# EAGLE design qsop28_to_dip (EAGLE 6.2)
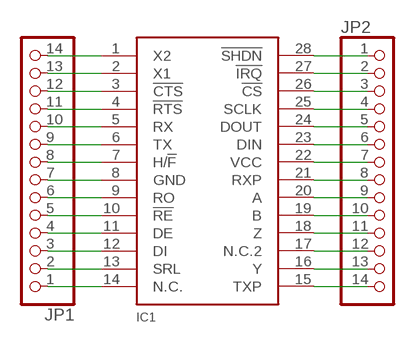
[diagram p0: schematic, sheet 1]

## Parts
IC1  MAX314028SQSOP  [28QSOP]
JP1  PINHD-1X14  [1X14]
JP2  PINHD-1X14  [1X14]

## Nets
N$1: IC1.1(X2) JP1.14
N$2: IC1.2(X1) JP1.13
N$3: IC1.3(!CTS) JP1.12
N$4: IC1.4(!RTS) JP1.11
N$5: IC1.5(RX) JP1.10
N$6: IC1.6(TX) JP1.9
N$7: IC1.7(H/!F) JP1.8
N$8: IC1.8(GND) JP1.7
N$9: IC1.9(RO) JP1.6
N$10: IC1.10(!RE) JP1.5
N$11: IC1.11(DE) JP1.4
N$12: IC1.12(DI) JP1.3
N$13: IC1.13(SRL) JP1.2
N$14: IC1.14(N.C.) JP1.1
N$15: IC1.28(!SHDN) JP2.1
N$16: IC1.27(!IRQ) JP2.2
N$17: IC1.26(!CS) JP2.3
N$18: IC1.25(SCLK) JP2.4
N$19: IC1.24(DOUT) JP2.5
N$20: IC1.23(DIN) JP2.6
N$21: IC1.22(VCC) JP2.7
N$22: IC1.21(RXP) JP2.8
N$23: IC1.20(A) JP2.9
N$24: IC1.19(B) JP2.10
N$25: IC1.18(Z) JP2.11
N$26: IC1.17(N.C.2) JP2.12
N$27: IC1.16(Y) JP2.13
N$28: IC1.15(TXP) JP2.14

## Library data of the parts
IC1 = eagleParts:MAX3140
JP1 JP2 = pinhead:PINHD-1X14: PIN HEADER

## Board
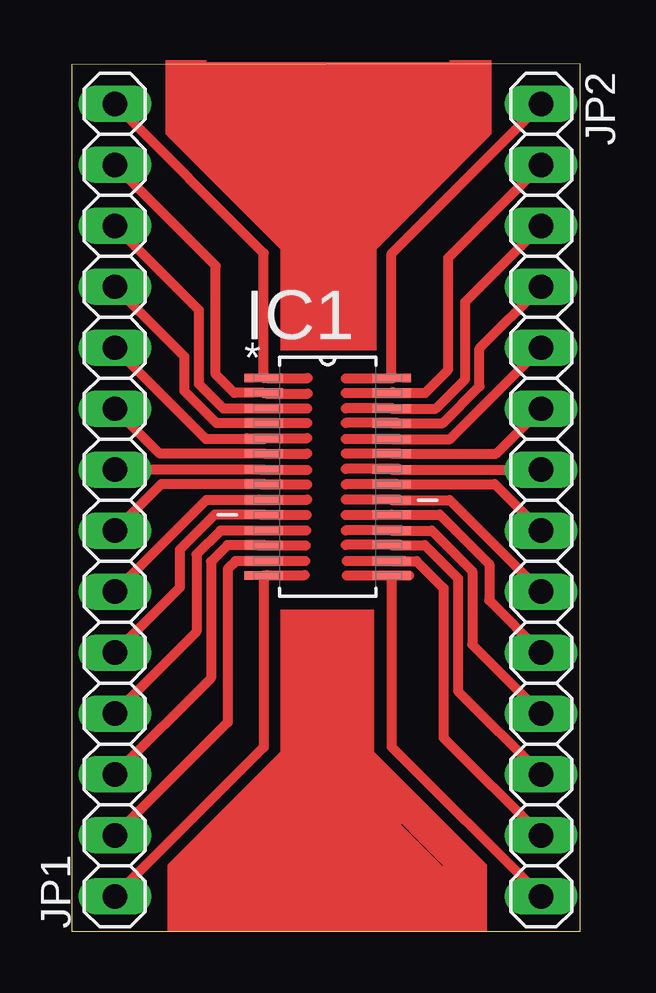
[diagram p1: board, top side]

Size 21.2 x 36.14 mm. Coordinates in mm from the lower left corner, seen from the top.
Outline: 0,0 21.2,0 21.2,36.14 0,36.1 0,0
Copper layers (1*16): Top 0.035mm / dielectric 1.5mm / Bottom 0.035mm
Design rules: minimum track width 10mil, minimum drill 24mil, track to track 8mil, track to pad 8mil, pad to pad 8mil, via to via 8mil, smd to smd 8mil, copper to edge 40mil, drill to drill 8mil, minimum pad ring 10mil, minimum via ring 8mil, stop-mask expansion 4mil, vias tented up to drill 0mil, thermal gap 10mil

### Footprints (pad centres in the part's own frame; a part is rotated, then mirrored left to right if it is on the bottom)
28QSOP = smd 1.6 x 0.356: 1 -2.667,4.115; 2 -2.667,3.505; 3 -2.667,2.845; 4 -2.667,2.235; 5 -2.667,1.575; 6 -2.667,0.965; 7 -2.667,0.305; 8 -2.667,-0.305; 9 -2.667,-0.965; 10 -2.667,-1.575; 11 -2.667,-2.235; 12 -2.667,-2.845; 13 -2.667,-3.505; 14 -2.667,-4.115; 15 2.667,-4.115; 16 2.667,-3.505; 17 2.667,-2.845; 18 2.667,-2.235; 19 2.667,-1.575; 20 2.667,-0.965; 21 2.667,-0.305; 22 2.667,0.305; 23 2.667,0.965; 24 2.667,1.575; 25 2.667,2.235; 26 2.667,2.845; 27 2.667,3.505; 28 2.667,4.115
1X14 = drill 1.016 long: 1 -16.51,0; 2 -13.97,0; 3 -11.43,0; 4 -8.89,0; 5 -6.35,0; 6 -3.81,0; 7 -1.27,0; 8 1.27,0; 9 3.81,0; 10 6.35,0; 11 8.89,0; 12 11.43,0; 13 13.97,0; 14 16.51,0

### Placement (x,y rotation side)
IC1  10.67,18.93 0 top
JP1  1.79,17.96 90 top
JP2  19.57,17.96 270 top

### Tracks (layer width: path | path; a pad name or v marks a point on that pad's centre or on a via)
N$1
  Top 0.406: IC1.1 8,28.26 JP1.14
N$2
  Top 0.406: IC1.2 6.77,22.44 6,23.2 6,27.72 JP1.13
N$3
  Top 0.406: IC1.3 6.33,21.77 5.3,22.8 5.3,25.88 JP1.12
N$4
  Top 0.406: IC1.4 6.04,21.16 4.7,22.5 4.7,23.94 JP1.11
N$5
  Top 0.406: IC1.5 5.6,20.51 JP1.10
N$6
  Top 0.406: IC1.6 3.67,19.9 JP1.9
N$7
  Top 0.406: IC1.7 JP1.8
N$8
  Top 0.406: IC1.8 3.72,18.62 JP1.7
N$9
  Top 0.406: IC1.9 5.61,17.96 JP1.6
N$10
  Top 0.406: IC1.10 5.96,17.35 4.5,15.9 4.5,14.32 JP1.5
N$11
  Top 0.406: IC1.11 6.2,16.7 5.2,15.7 5.2,12.48 JP1.4
N$12
  Top 0.406: IC1.12 6.49,16.09 5.8,15.4 5.8,10.54 JP1.3
N$13
  Top 0.406: IC1.13 6.83,15.42 6.5,15.1 6.5,8.7 JP1.2
N$14
  Top 0.406: IC1.14 8,7.66 JP1.1
N$15
  Top 0.406: IC1.28 13.34,28.24 JP2.1
N$16
  Top 0.406: IC1.27 14.74,22.44 15.7,23.4 15.7,28.06 JP2.2
N$17
  Top 0.406: IC1.26 15.17,21.77 16.4,23 16.4,26.22 JP2.3
N$18
  Top 0.406: IC1.25 15.47,21.16 17,22.7 17,24.28 JP2.4
N$19
  Top 0.406: IC1.24 15.76,20.51 JP2.5
N$20
  Top 0.406: IC1.23 17.7,19.9 JP2.6
N$21
  Top 0.406: IC1.22 JP2.7
N$22
  Top 0.406: IC1.21 17.63,18.62 JP2.8
N$23
  Top 0.406: IC1.20 15.76,17.96 JP2.9
N$24
  Top 0.406: IC1.19 15.35,17.35 17.4,15.3 17.4,13.78 JP2.10
N$25
  Top 0.406: IC1.18 15.01,16.7 16.7,15 16.7,11.94 JP2.11
N$26
  Top 0.406: IC1.17 14.72,16.09 16.1,14.7 16.1,10 JP2.12
N$27
  Top 0.406: IC1.16 14.38,15.42 15.5,14.3 15.5,8.06 JP2.13
N$28
  Top 0.406: IC1.15 13.34,7.68 JP2.14
N$29
  Top 0.406: 4.2,2.5 4.2,2.7 10.2,8.7
N$30
  Top 0.406: 17.1,2.5 17.1,2.7 10.9,8.9 10.9,8.4 16.7,2.6 16.3,2.6 12.3,6.6 12.3,6.2 16.1,2.4 15.5,2.4 12.1,5.8 12.1,5.5 15,2.6 14.5,2.6 12.9,4.2 12.9,3.7 13.9,2.7 13.6,2.7 13.4,2.9 8.4,2.9 7.8,2.3 7.8,2.9 8.7,3.8 8.3,3.8 6.8,2.3 7,2.3 8.7,4 8,4 6.7,2.7 6.7,2.9 9.2,5.4 9.2,6.5 8.8,6.9 8.8,6.8 4.5,2.5 5,2.5 8.9,6.4 8.9,5.9 5.3,2.3 5.7,2.3 9.6,6.2 9.6,5.9 5.9,2.2
N$31
  Top 0.406: 8.14,5.26 8.14,2.72 10.68,2.72 13.22,5.26 12.84,5.26 12.4,5.7 12.5,5.7 13.6,4.6
N$32
  Top 0.406: 4.1,33.3 9.5,27.9 11.9,27.9 17.3,33.3 16.7,33.3 12.5,29.1 12.5,29.5 16.3,33.3 15.7,33.3 12.5,30.1 12.5,30.6 15.4,33.5 15,33.5 12.6,31.1 12.6,31.5 14.6,33.5 14.2,33.5 12.7,32 12.7,32.4 13.6,33.3 13.2,33.3 12.7,32.8 12.7,33.1 12.8,33.2 7.3,33.2 | 6.9,33.2 5.6,33.2 | 5.6,33.2 4.6,33.2 8.8,29 8.8,29.5 4.9,33.4 5.5,33.4 9.1,29.8 9.1,30.3 6.3,33.1 6.6,33.1 8.7,31 8.7,31.4 6.9,33.2 | 6.9,33.2 7.3,33.2 | 7.3,33.2 8.8,31.7 8.8,32.2 8,33 8.4,33 8.7,32.7 8.7,32.8 8.8,32.9 5.9,32.9 5.6,33.2 | 5.6,33.2 5.6,33 8.7,29.9 12.5,29.9 12.9,30.3 13.1,30.3 16,33.2 16.7,33.2 16.8,33.1 16.7,33.1 12.7,29.1
N$33
  Top 0.406: 8.14,23.04 9.84,23.04
N$34
  Top 0.406: 8.1,22.4 9.84,22.4
N$35
  Top 0.406: 7.62,21.78 9.82,21.78
N$36
  Top 0.406: 7.34,21.18 9.82,21.18
N$37
  Top 0.406: 7.26,20.5 arc-90 7.3,20.54 9.82,20.54
N$38
  Top 0.406: 8.02,19.9 9.82,19.9
N$39
  Top 0.406: 7.9,19.22 9.82,19.22
N$40
  Top 0.406: 7.9,18.62 9.82,18.62
N$41
  Top 0.406: 7.82,17.98 9.82,17.98
N$42
  Top 0.406: 7.9,17.34 arc-90 7.91,17.35 9.8,17.35
N$43
  Top 0.406: 7.78,16.7 9.77,16.7
N$44
  Top 0.406: 7.78,16.08 9.75,16.08
N$45
  Top 0.406: 7.94,15.42 arc-90 7.95,15.43 9.74,15.43
N$46
  Top 0.406: 8.13,14.83 arc-90 8.14,14.84 9.71,14.84
N$47
  Top 0.406: 13.34,23.02 11.42,23.02
N$48
  Top 0.406: 13.38,22.46 arc-90 13.34,22.42 11.42,22.42
N$49
  Top 0.406: 13.38,21.78 11.42,21.78
N$50
  Top 0.406: 13.58,21.18 11.42,21.18
N$51
  Top 0.406: 13.62,20.5 11.42,20.5
N$52
  Top 0.406: 13.66,19.9 11.42,19.9
N$53
  Top 0.406: 13.66,19.22 arc90 13.62,19.26 11.42,19.26
N$54
  Top 0.406: 13.58,18.62 11.42,18.62
N$55
  Top 0.406: 13.62,17.98 11.42,17.98
N$56
  Top 0.406: 13.58,17.34 11.42,17.34
N$57
  Top 0.406: 13.74,16.7 11.42,16.7
N$58
  Top 0.406: 13.7,16.1 11.42,16.1
N$59
  Top 0.406: 13.86,15.42 11.46,15.42
N$60
  Top 0.406: 14.06,14.82 11.46,14.82
(copper drawn outside any net)
  shapes: Top area x10